# Altium schematic sheet MCU_IO.SchDoc
size A3; SheetNumber: 4; SheetTotal: 6
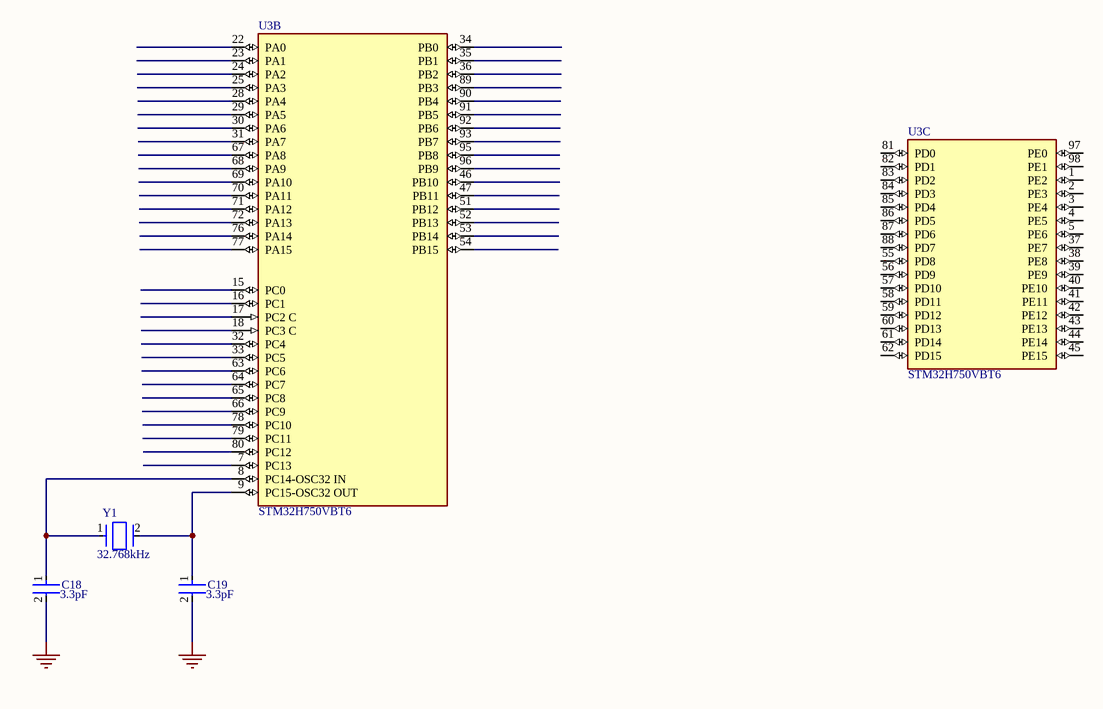
[diagram p0: MCU_IO.SchDoc]

## Parts
C18  Capacitance: 3.3pF  [FP-GCM155-0_05-IPC_C]  (hidden comment: GCM1555C1H3R3CA16J)
C19  Capacitance: 3.3pF  [FP-GCM155-0_05-IPC_C]  (hidden comment: GCM1555C1H3R3CA16J)
U3  STM32H750VBT6  [FP-LQFP100-1L-MFG]  (parts B,C of 3)
Y1  Frequency: 32.768kHz  [FP-ECX-34Q-MFG]  (hidden comment: ECS-.327-6-34QCN-TR)

## Nets
GND: C18.2 C19.2
NetC18_1: C18.1 U3.8(PC14-OSC32_IN) Y1.1(In/Out)
NetC19_1: C19.1 U3.9(PC15-OSC32_OUT) Y1.2(Out/In)

Not connected (* = marked no-connect by the designer): U3 1(PE2) 2(PE3) 3(PE4) 4(PE5) 5(PE6) 7(PC13) 15(PC0) 16(PC1) 17(PC2_C) 18(PC3_C) 22(PA0) 23(PA1) 24(PA2) 25(PA3) 28(PA4) 29(PA5) 30(PA6) 31(PA7) 32(PC4) 33(PC5) 34(PB0) 35(PB1) 36(PB2) 37(PE7) 38(PE8) 39(PE9) 40(PE10) 41(PE11) 42(PE12) 43(PE13) 44(PE14) 45(PE15) 46(PB10) 47(PB11) 51(PB12) 52(PB13) 53(PB14) 54(PB15) 55(PD8) 56(PD9) 57(PD10) 58(PD11) 59(PD12) 60(PD13) 61(PD14) 62(PD15) 63(PC6) 64(PC7) 65(PC8) 66(PC9) 67(PA8) 68(PA9) 69(PA10) 70(PA11) 71(PA12) 72(PA13) 76(PA14) 77(PA15) 78(PC10) 79(PC11) 80(PC12) 81(PD0) 82(PD1) 83(PD2) 84(PD3) 85(PD4) 86(PD5) 87(PD6) 88(PD7) 89(PB3) 90(PB4) 91(PB5) 92(PB6) 93(PB7) 95(PB8) 96(PB9) 97(PE0) 98(PE1)

## Library data of the parts
C18 C19 = CMP-06035-005325-1: Ceramic Capacitor for Automotive 3.3pF ±0.25pF 50VDC C0G 0402 Paper T/R; Voltage Rating (DC): 50V; Packaging: Tape and Reel; Max Operating Temperature: 125°C; Length: 0.039inch; Min Operating Temperature: -55°C; Ratings: AEC-Q200; Voltage Rating: 50V; Case Code (Metric): 1005; Width: 0.5mm; Case/Package: 0402; Height: 0.5mm; Weight: 0.000212oz; Mount: Surface Mount; Termination: SMD/SMT; Thickness: 0.022inch; Package Quantity: 50000; Dielectric: C0G; Case Code (Imperial): 0402
U3 = CMP-12105-000017-1: IC MCU 32BIT 128KB FLASH 100LQFP; Manufacturer: STMicroelectronics; Number Of Uart Channels: 9; Number Of I/Os: 82; Max Junction Temp: +125°C; Data Bus Width: 32bits; Ram Size: 1MBytes; Min Supply Voltage: 1.62V; Number Of Spi Channels: 6; Number Of Adc Channels: 36; Max Supply Voltage: 3.6V; Standoff Height: 0.05mm; Interface: I2C,SPI,UART,USART,CAN,USB,LIN,IrDA,Ethernet,I2S,Other; Number Of A/D Converters: 3; Number Of I2C Channels: 4; Memory Size: 128KBytes; Frequency: 480MHz; Number Of Timers/Counters: 20; Number Of Ethernet Channels: 1; Core Architecture: ARM Cortex-M7; Number Of Usb Channels: 2; Number Of Pwm Channels: 42; Ambient Temperature Range High: +85°C; Temperature: -40°C to +125°C; ComponentLink2URL: https://www.st.com/resource/en/datasheet/stm32h750vb.pdf; Device Class L2: Embedded Processors and Controllers; Temperature Range Low: -40°C; Octopart: https://octopart.com/stm32h750vbt6-stmicroelectronics-94048547; Category: IC; Manufacturer Part Number: STM32H750VBT6; Height: 1.6mm; Lead Free: Yes; Device Class L1: Integrated Circuits (ICs); Digikey Description: IC MCU 32BIT 128KB FLASH 100LQFP; RoHS: TRUE; Ambient Temperature Range Low: -40°C; Device Class L3: Microcontrollers; ComponentLink2Description: Datasheet; Mouser Description: MCU 32-Bit STM32H750VB ARM Cortex M7 RISC 128KB Flash 1.8V/2.5V/3.3V 100-Pin LQFP Tray; Number Of Cores: 1; Automotive: No; Memory Type: FLASH; Package: LQFP100-1L; Temperature Range High: +125°C
Y1 = CMP-40224-000010-1: CRYSTAL 32.768KHZ 6PF SMD; Manufacturer: ECS Inc.; Esr: 70kΩ; Tolerance: 10ppm; Automotive Grade: Grade 3; ComponentLink2Description: Datasheet; Automotive: Yes; Temperature Range Low: -40°C; Manufacturer Part Number: ECS-.327-6-34QCN-TR; Device Class L2: Crystals / Oscillators; Temperature Range High: +85°C; Series: ECX-34Q; ComponentLink2URL: https://ecsxtal.com/store/pdf/ECX-34Q.pdf; Device Class L3: Crystals; Device Class L1: Passive Components; Octopart: https://octopart.com/ecs-.327-6-34qcn-tr-ecs+international-97157707; Load Capacitance: 6pF; Temperature: -40°C to +85°C; Category: Crys; Lead Free: Yes; Package: ECX-34Q; RoHS: TRUE; Digikey Description: CRYSTAL 32.768KHZ 6PF SMD; Height: 0.9mm